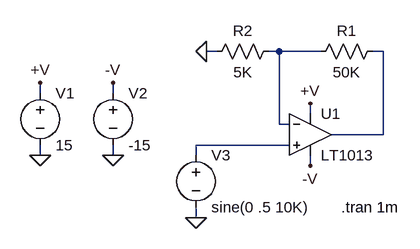
[diagram p0: schematic 1013.asc]
1013.asc, the LTspice schematic file:
Version 4
SHEET 1 1028 680
WIRE 192 0 176 0
WIRE 288 0 272 0
WIRE 352 0 288 0
WIRE 448 0 432 0
WIRE -80 64 -80 48
WIRE 32 64 32 48
WIRE 336 96 336 80
WIRE 288 112 288 0
WIRE 304 112 288 112
WIRE 448 128 448 0
WIRE 448 128 368 128
WIRE 304 144 160 144
WIRE -80 160 -80 144
WIRE 32 160 32 144
WIRE 160 160 160 144
WIRE 336 176 336 160
WIRE 160 256 160 240
FLAG -80 160 0
FLAG 336 80 +V
FLAG -80 48 +V
FLAG 176 0 0
FLAG 160 256 0
FLAG 32 160 0
FLAG 32 48 -V
FLAG 336 176 -V
SYMBOL voltage -80 48 R0
WINDOW 39 24 125 Left 2
SYMATTR InstName V1
SYMATTR Value 15
SYMBOL opamps\\LT1013 336 64 R0
SYMATTR InstName U1
SYMBOL res 448 -16 R90
WINDOW 0 0 56 VBottom 2
WINDOW 3 32 56 VTop 2
SYMATTR InstName R1
SYMATTR Value 50K
SYMBOL res 288 -16 R90
WINDOW 0 0 56 VBottom 2
WINDOW 3 32 56 VTop 2
SYMATTR InstName R2
SYMATTR Value 5K
SYMBOL voltage 160 144 R0
SYMATTR InstName V3
SYMATTR Value sine(0 .5 10K)
SYMBOL voltage 32 48 R0
WINDOW 39 24 125 Left 2
SYMATTR InstName V2
SYMATTR Value -15
TEXT 384 240 Left 2 !.tran 1m

The netlist it stands for:
* 1013.asc
V1 +V 0 15
XU1 N003 N001 +V -V N002 LT1013  ; pins In+ In- V+ V- OUT
R1 N002 N001 50K
R2 N001 0 5K
V3 N003 0 sine(0 .5 10K)
V2 -V 0 -15
.tran 1m
.lib LTC.lib
.backanno
.end